# Altium schematic sheet Microcontroller.SchDoc
size A3; SheetNumber: 3; SheetTotal: 7
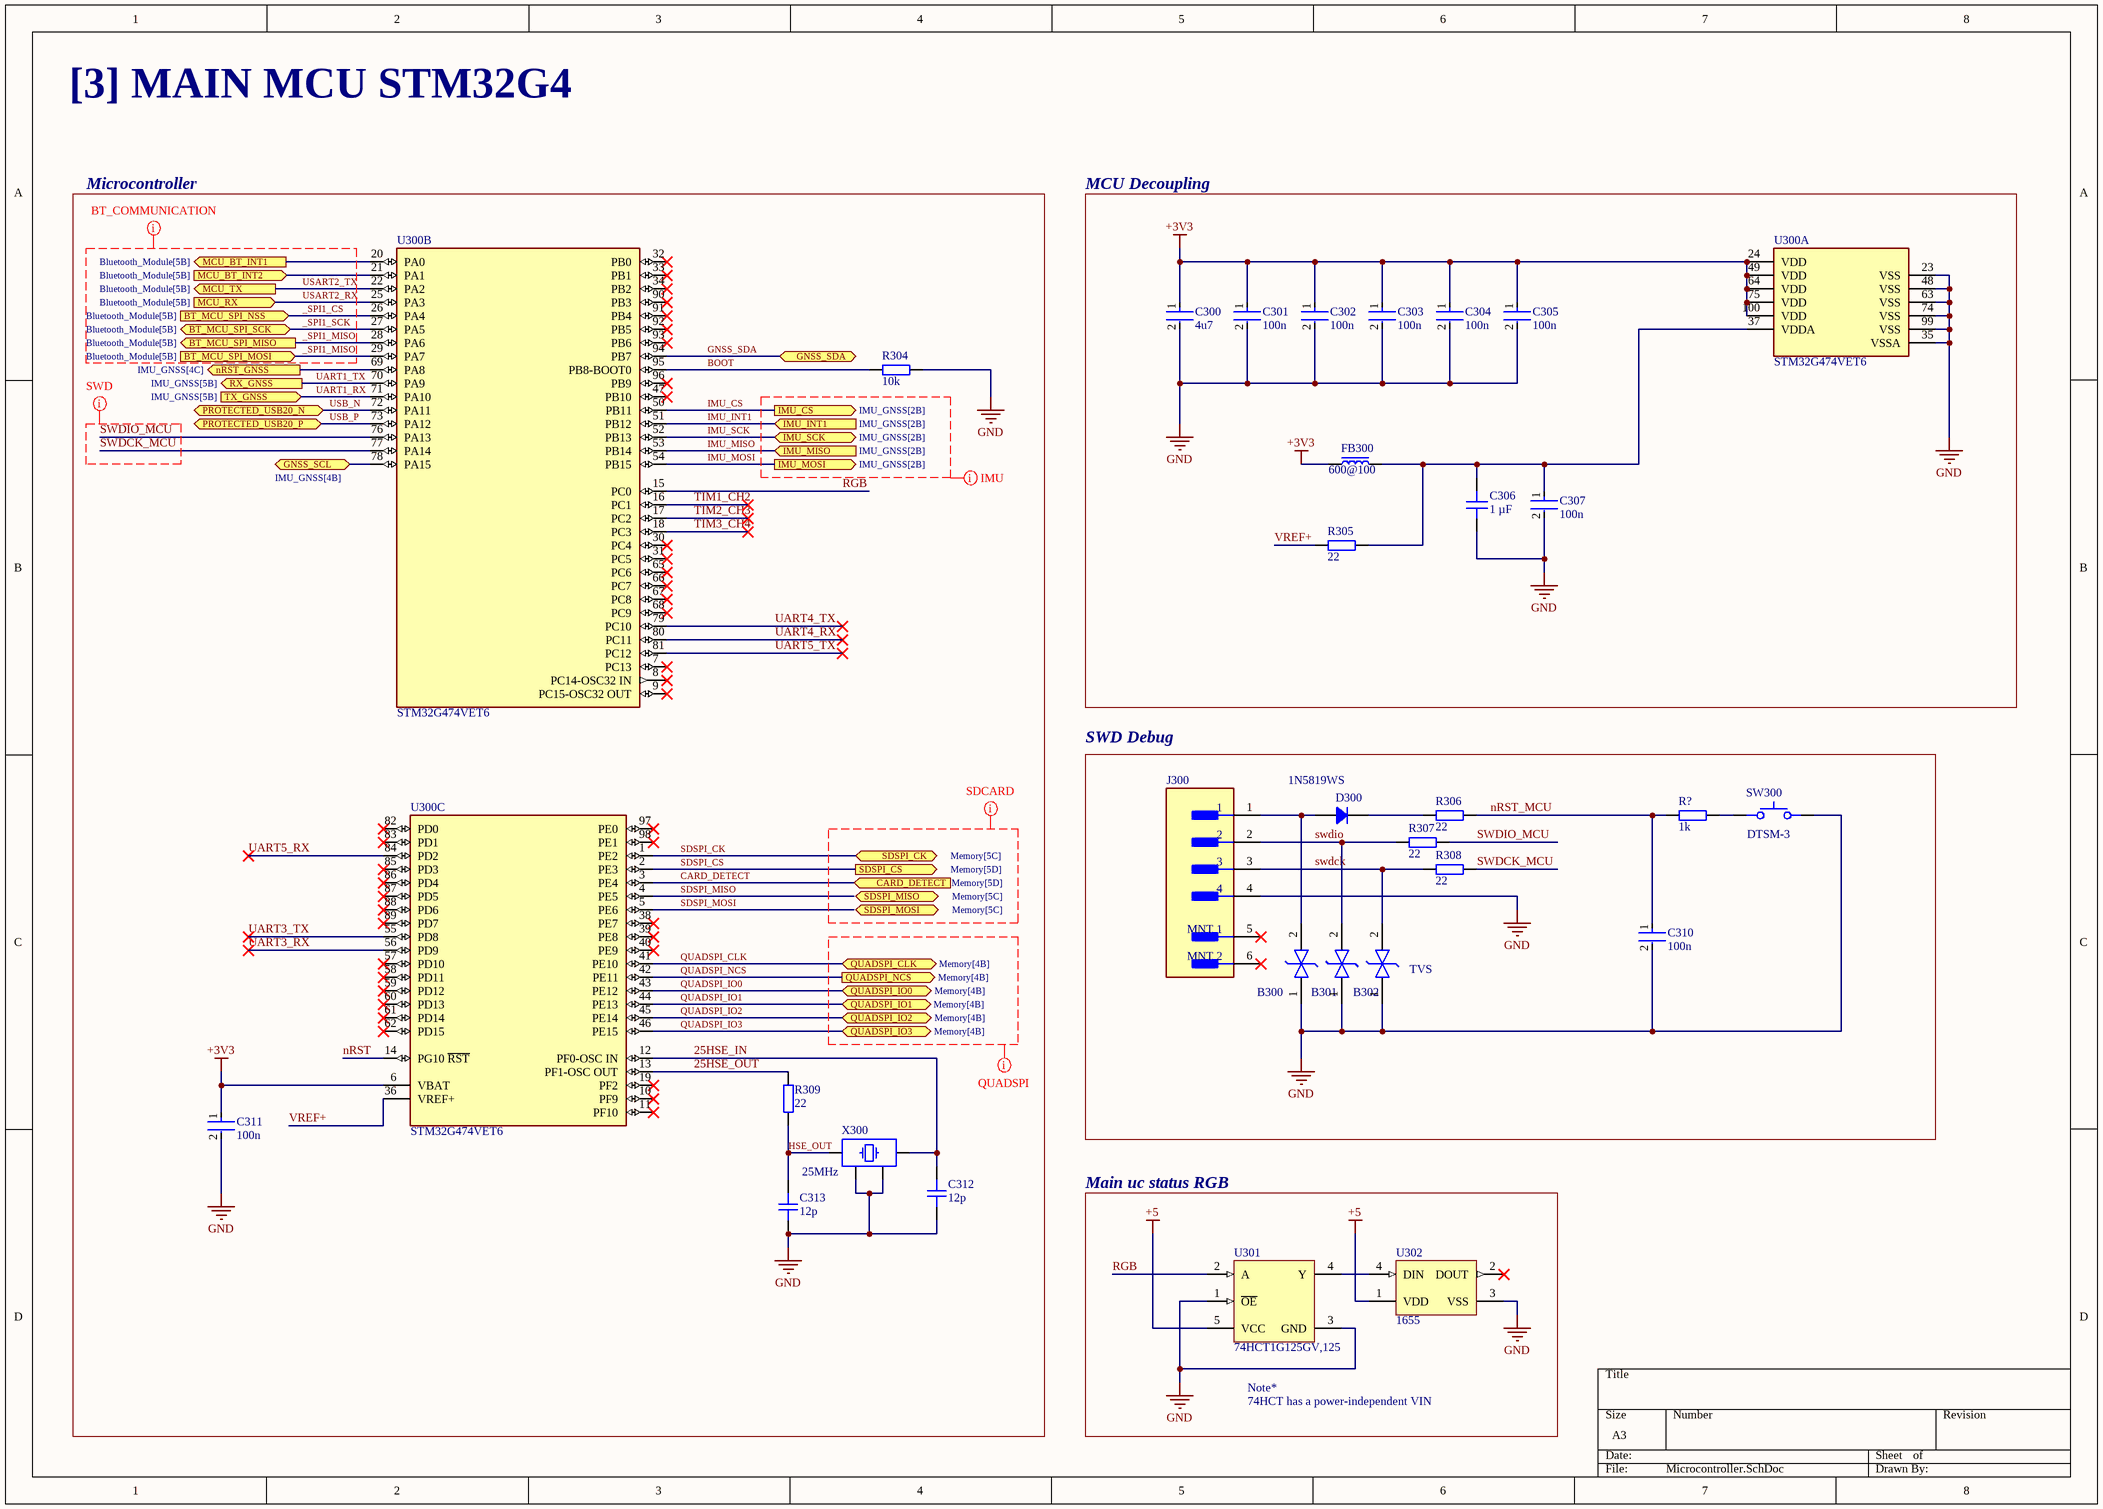
[diagram p0: Microcontroller.SchDoc]

## Parts
B300  TVS  [SODFL1608X65N]  (value not drawn)
B301  TVS  [SODFL1608X65N]  (value not drawn)
B302  TVS  [SODFL1608X65N]
C300  4u7  [FP-CL10-IPC_C]
C301  100n  [FP-CL779-IPC_C]
C302  100n  [FP-CL779-IPC_C]
C303  100n  [FP-CL779-IPC_C]
C304  100n  [FP-CL779-IPC_C]
C305  100n  [FP-CL779-IPC_C]
C306  1 µF  [CAP 0402_1005]
C307  100n  [FP-CL779-IPC_C]
C310  100n  [FP-CL779-IPC_C]
C311  100n  [FP-CL779-IPC_C]
C312  12p  [CAP_0402]
C313  12p  [CAP_0402]
D300  1N5819WS  [SOD323F]
FB300  600@100  [FB_0603]
J300  S4B-XH-SM4-TB(LF)(SN)  [FP-S4B-XH-SM4-TB_LF_SN-MFG]  (value not drawn)
R304  10k  [RES_0402]
R305  22  [RES_0402]
R306  22  [RES_0402]
R307  22  [RES_0402]
R308  22  [RES_0402]
R309  22  [RES_0402]
R?  1k  [RES_0402]
SW300  DTSM-3  [DTSM-3]
U300  STM32G474VET6  [FP-LQFP100-1L-IPC_B]  (parts A,B,C of 3)
U301  74HCT1G125GV,125  [NXP-SOT753_V]
U302  1655  [ADA-RGB-1655_V]
X300  25MHz  [XTAL_3225]

## Blocks framed on the sheet
Microcontroller: C311-C313 R304 R309 U300 X300
MCU Decoupling: C300-C307 FB300 R305 U300
SWD Debug: B300-B302 C310 D300 J300 R306-R308 R? SW300
Main uc status RGB: U301 U302

## Ports
BT_MCU_SPI_MISO (out, see Bluetooth_Module[5B]), BT_MCU_SPI_MOSI (in, see Bluetooth_Module[5B]), BT_MCU_SPI_NSS (in, see Bluetooth_Module[5B]), BT_MCU_SPI_SCK (bidir, see Bluetooth_Module[5B]), CARD_DETECT (in, see Memory[5D]), GNSS_SCL (bidir, see IMU_GNSS[4B]), GNSS_SDA (bidir, see IMU_GNSS[4B]), IMU_CS (out, see IMU_GNSS[2B]), IMU_INT1 (in, see IMU_GNSS[2B]), IMU_MISO (in, see IMU_GNSS[2B]), IMU_MOSI (out, see IMU_GNSS[2B]), IMU_SCK (bidir, see IMU_GNSS[2B]), MCU_BT_INT1 (out, see Bluetooth_Module[5B]), MCU_BT_INT2 (in, see Bluetooth_Module[5B]), MCU_RX (in, see Bluetooth_Module[5B]), MCU_TX (out, see Bluetooth_Module[5B]), nRST_GNSS (out, see IMU_GNSS[4C]), PROTECTED_USB20_N (bidir, see Connectors[2B]), PROTECTED_USB20_P (bidir, see Connectors[2B]), QUADSPI_CLK (bidir, see Memory[4B]), QUADSPI_IO0 (bidir, see Memory[4B]), QUADSPI_IO1 (bidir, see Memory[4B]), QUADSPI_IO2 (bidir, see Memory[4B]), QUADSPI_IO3 (bidir, see Memory[4B]), QUADSPI_NCS (out, see Memory[4B]), RX_GNSS (out, see IMU_GNSS[5B]), SDSPI_CK (bidir, see Memory[5C]), SDSPI_CS (out, see Memory[5D]), SDSPI_MISO (bidir, see Memory[5C]), SDSPI_MOSI (bidir, see Memory[5C]), TX_GNSS (in, see IMU_GNSS[5B])

## Nets
+3V3: C300.1 C301.1 C302.1 C303.1 C304.1 C305.1 C311.1 FB300.1 U300.6(VBAT) U300.24(VDD) U300.49(VDD) U300.64(VDD) U300.75(VDD) U300.100(VDD)
+5: U301.5(VCC) U302.1(VDD)
GND: B300.1(K1) B301.1(K1) B302.1(K1) C300.2 C301.2 C302.2 C303.2 C304.2 C305.2 C306.1 C307.2 C310.2 C311.2 C312.1 C313.1 J300.4 R304.1 SW300.2 U300.23(VSS) U300.35(VSSA) U300.48(VSS) U300.63(VSS) U300.74(VSS) U300.99(VSS) U301.1(~{OE}) U301.3(GND) U302.3(VSS) X300.2 X300.4
25HSE_IN: C312.2 U300.12(PF0-OSC_IN) X300.3
25HSE_OUT: R309.1 U300.13(PF1-OSC_OUT)
_SPI1_CS: U300.26(PA4) ; port BT_MCU_SPI_NSS
_SPI1_MISO: U300.28(PA6) U300.29(PA7) ; port BT_MCU_SPI_MOSI, port BT_MCU_SPI_MISO
_SPI1_SCK: U300.27(PA5) ; port BT_MCU_SPI_SCK
BOOT: R304.2 U300.95(PB8-BOOT0)
CARD_DETECT: U300.3(PE4) ; port CARD_DETECT
GNSS_SCL: U300.78(PA15) ; port GNSS_SCL
GNSS_SDA: U300.94(PB7) ; port GNSS_SDA
HSE_OUT: C313.2 R309.2 X300.1
IMU_CS: U300.50(PB11) ; port IMU_CS
IMU_INT1: U300.51(PB12) ; port IMU_INT1
IMU_MISO: U300.53(PB14) ; port IMU_MISO
IMU_MOSI: U300.54(PB15) ; port IMU_MOSI
IMU_SCK: U300.52(PB13) ; port IMU_SCK
MCU_BT_INT1: U300.20(PA0) ; port MCU_BT_INT1
MCU_BT_INT2: U300.21(PA1) ; port MCU_BT_INT2
nRST: U300.14(PG10_~{RST})
nRST_GNSS: U300.69(PA8) ; port nRST_GNSS
nRST_MCU: C310.1 R306.1 R?.2
QUADSPI_CLK: U300.41(PE10) ; port QUADSPI_CLK
QUADSPI_IO0: U300.43(PE12) ; port QUADSPI_IO0
QUADSPI_IO1: U300.44(PE13) ; port QUADSPI_IO1
QUADSPI_IO2: U300.45(PE14) ; port QUADSPI_IO2
QUADSPI_IO3: U300.46(PE15) ; port QUADSPI_IO3
QUADSPI_NCS: U300.42(PE11) ; port QUADSPI_NCS
RGB: U300.15(PC0) U301.2(A)
SDSPI_CK: U300.1(PE2) ; port SDSPI_CK
SDSPI_CS: U300.2(PE3) ; port SDSPI_CS
SDSPI_MISO: U300.4(PE5)
SDSPI_MOSI: U300.5(PE6)
swdck: B302.2(K2) J300.3 R308.2
SWDCK_MCU: R308.1 U300.77(PA14)
swdio: B301.2(K2) J300.2 R307.2
SWDIO_MCU: R307.1 U300.76(PA13)
TIM1_CH2: U300.16(PC1)
TIM2_CH3: U300.17(PC2)
TIM3_CH4: U300.18(PC3)
UART1_RX: U300.71(PA10) ; port TX_GNSS
UART1_TX: U300.70(PA9) ; port RX_GNSS
UART3_RX: U300.56(PD9)
UART3_TX: U300.55(PD8)
UART4_RX: U300.80(PC11)
UART4_TX: U300.79(PC10)
UART5_RX: U300.84(PD2)
UART5_TX: U300.81(PC12)
USART2_RX: U300.25(PA3) ; port MCU_RX
USART2_TX: U300.22(PA2) ; port MCU_TX
USB_N: U300.72(PA11) ; port PROTECTED_USB20_N
USB_P: U300.73(PA12) ; port PROTECTED_USB20_P
VREF+: R305.1 U300.36(VREF+)
NetB300_2: B300.2(K2) D300.1 J300.1
NetC306_2: C306.2 C307.1 FB300.2 R305.2 U300.37(VDDA)
NetD300_2: D300.2 R306.2
NetR?_1: R?.1 SW300.1
NetU301_4: U301.4(Y) U302.4(DIN)

Not connected (* = marked no-connect by the designer): J300 5(MNT_1)* 6(MNT_2)*; U300 7(PC13)* 8(PC14-OSC32_IN)* 9(PC15-OSC32_OUT)* 10(PF9)* 11(PF10)* 19(PF2)* 30(PC4)* 31(PC5)* 32(PB0)* 33(PB1)* 34(PB2)* 38(PE7)* 39(PE8)* 40(PE9)* 47(PB10)* 57(PD10)* 58(PD11)* 59(PD12)* 60(PD13)* 61(PD14)* 62(PD15)* 65(PC6)* 66(PC7)* 67(PC8)* 68(PC9)* 82(PD0)* 83(PD1)* 85(PD3)* 86(PD4)* 87(PD5)* 88(PD6)* 89(PD7)* 90(PB3)* 91(PB4)* 92(PB5)* 93(PB6)* 96(PB9)* 97(PE0)* 98(PE1)*; U302 2(DOUT)*

## Layout directives
net class DEBUG: SWDCK_MCU, SWDIO_MCU
net class QUADSPI: (no net found under the mark)
net class IMU_SPI: (no net found under the mark)
net class BT_MCU_COMMUNICATION: _SPI1_CS, _SPI1_MISO, _SPI1_SCK, USART2_RX, USART2_TX
net class SD: (no net found under the mark)

## Notes on the sheet
- [3] MAIN MCU STM32G4
- Note*
- 74HCT has a power-independent VIN

## Library data of the parts
B300-B302 = PESD5V0S1BB_115: PESD5V0S1BB - Bidirectional ESD protection diode Vbr = 5.5V, Vc; Manufacturer_Name: Nexperia; Manufacturer_Part_Number: PESD5V0S1BB,115; Geometry.Height: 0.65mm; Mouser Part Number: 771-PESD5V0S1BB-T/R; Mouser Price/Stock: https://www.mouser.co.uk/ProductDetail/Nexperia/PESD5V0S1BB115?qs=LOCUfHb8d9vW06zz0pOppQ%3D%3D; Arrow Part Number: PESD5V0S1BB,115; Arrow Price/Stock: https://www.arrow.com/en/products/pesd5v0s1bb115/nexperia; Datasheet Link: https://assets.nexperia.com/documents/data-sheet/PESD5V0S1BB.pdf
C300 = CMP-13271-004224-1: Cap Ceramic 10uF 25V X5R ±20% Pad SMD 0603 +85°C T/R; Width: 0.031inch; Voltage Rating: 25V; Length: 0.063inch; Case Code (Metric): 1608; Dielectric: X5R; Termination: Wraparound; Capacitance: 10uF; Lead Free: Lead Free; Mount: Surface Mount; Package Quantity: 1; Case Code (Imperial): 0603; Thickness: 0.035inch; Packaging: Tape and Reel; Contact Plating: Tin; Min Operating Temperature: -55°C; Tolerance: 20%; Max Operating Temperature: 85°C; Case/Package: 0603
C301-C305 C307 C310 C311 = CMP-13271-002336-1: Cap Ceramic 100nF 50V X7R ±10% SMD 0402 +125°C Paper T/R CL05B104KB54PNC
C306 = CL05A105KA5NQNC: CAP CER 1UF 25V X5R 0402; manufacturer: Samsung Electro-Mechanics; Tolerance: ±10%; Part Number: CL05A105KA5NQNC; Value: 1 µF; Applications: General Purpose; Capacitance: 1 µF; componentlink1description: Datasheet; componentlink1url: http://www.samsungsem.com/kr/support/product-search/mlcc/CL05A105KA5NQNC.jsp; componentlink2description: DigiKey Link; componentlink2url: https://www.digikey.com/en/products/detail/samsung-electro-mechanics/CL05A105KA5NQNC/3887103; Device Package: 0402 (1005 Metric); lastupdated: 26.01.2024 20:04:14; Lifecycle Status: Active; Minimum Order: 1; Mounting Type: Surface Mount, MLCC; Operating Temperature: -55°C ~ 85°C; Package / Case: 0402 (1005 Metric); packaging: TapeAndReel; partid: 8675; Part Status: Active; price: 0.02; series: CL; Size / Dimension: 0.039" L x 0.020" W (1.00mm x 0.50mm); Supplier 1: DigiKey; Supplier Part Number 1: 1276-1445-1-ND; Temperature Coefficient: X5R; Thickness (Max): 0.022" (0.55mm); Voltage - Rated: 25V
C312 C313 = CAP_0402: Capacitor SMD 0402 0402CG120J500NT; Manufacturer: *; Manufacturer Part Number: *; Distributor Link: *; LCSC: *; Rating: *; Dielectric: *
D300 = 1N4148WS: 40V 600mV@1A 1A SOD-323 1N5819WS; Manufacturer: ON Semiconductor; Current - Average Rectified (Io): 150mA; Current - Reverse Leakage @ Vr: 5µA @ 75V; Diode Type: Standard; Reverse Recovery Time (trr): 4ns; Speed: Small Signal =< 200mA (Io), Any Speed; Voltage - DC Reverse (Vr) (Max): 75V; Voltage - Forward (Vf) (Max) @ If: 1V @ 10mA; Part Number: 1N4148WS; ComponentLink1Description: Datasheet; ComponentLink1URL: https://www.onsemi.com/pub/Collateral/1N914BWS-D.pdf; ComponentLink2Description: DigiKey Link; ComponentLink2URL: http://digikey.com/product-detail/en/on-semiconductor/1N4148WS/1N4148WSFSCT-ND/1873821; LastUpdated: 29.01.2024 21:26:23; Lifecycle Status: Active; Minimum Order: 1; Mounting Type: Surface Mount; Operating Temperature - Junction: 150°C (Max); Package / Case: SC-90, SOD-323F; Packaging: TapeAndReel; PartId: 1158; Part Status: Active; Price: 0.03; Series: -; Supplier 1: DigiKey; Supplier Part Number 1: 1N4148WSFSCT-ND; Supplier Device Package: SOD-323F
FB300 = FB_0603: Ferrite Bead SMD 0603 GZ1608D601TF; Manufacturer: *; Manufacturer Part Number: *; Distributor Link: *; LCSC: *
J300 = CMP-17439-000072-1: CONN HEADER SMD R/A 4POS 2.5MM; Number of Positions: 4; Max Current Rating: 3A; Max Voltage Rating (AC): 250V; Connector Type: Male Pin; Contact Resistance: 20mR; Gender: Male; Pitch: 0.098inch; Max Operating Temperature: 85°C; Contact Plating: Tin; Housing Material: Polyamide; Housing Color: Beige; Depth: 10mm; Series: XH; Package Quantity: 1; Length: 15mm; Contact Material: Copper Alloy; Min Operating Temperature: -25°C; REACH SVHC: No SVHC; Orientation: Right Angle; Number of Rows: 1; Contact Type: Male Pin; Color: Natural; Lead Free: Lead Free; Termination: Solder; Mount: Surface Mount; Number of Contacts: 4; Packaging: Tape and Reel
R304-R309 R? = RES_0402: Resistor SMD 0402; Manufacturer: *; Manufacturer Part Number: *; Distributor Link: *; LCSC: *
SW300 = DTSM-3: Tactile Switch SMD SPST; Manufacturer: Diptronics; Manufacturer Part Number: DTSM-3
U300 = CMP-12105-000116-1: IC MCU 32BIT 512KB FLASH 100LQFP; RoHS Compliant: Yes
U301 = CMP-1328-00004-1: High-Speed, Si-Gate CMOS Device, 4.5 to 5.5 V, -40 to 125 degC, 5-Pin SC-74A (SOT753), RoHS, Reel; Manufacturer: NXP Semiconductors; Ci: 1.5 pF Typ.; CPD: 27 pF Typ.; VO: 0 to 5.5 V; PartNumber: 74HCT1G125GV,125; ComponentLink3Description: Package Specification; ComponentLink1URL: http://www.nxp.com/; Temperature Range: -40 to 125 degC; ComponentLink3URL: http://www.nxp.com/documents/outline_drawing/sot753_po.pdf; RoHS: TRUE; Mounting Technology: Surface Mount; PackageVersion: Mar-06; Packing: Reel; ComponentLink2Description: Datasheet; ComponentLink2URL: http://www.nxp.com/documents/data_sheet/74HC_HCT1G125.pdf; PackageDescription: 5-Pin Plastic Surface Mounted Package, Body 2.9 x 1.5 mm, Pitch 0.95 mm; DatasheetVersion: Rev. 05; VCC: 4.5 to 5.5 V; ComponentLink1Description: Manufacturer URL; VI: 0 to 5.5 V
U302 = CMP-2000-05026-1: Intelligent Control LED Integrated Light Source, 3.5 to 5.3 V, -25 to 80 degC, 4-Pin SMD, RoHS, Tape and Reel; Manufacturer: Adafruit-Industries-LLC; Number of LEDs: 10; Configuration: Discrete; Utilized LED: WS2812(5050); Datasheet URL: http://datasheet.octopart.com/ADA1655-Adafruit-Industries-datasheet-32028139.pdf; Series: Neopixel; Interface: -; Package Description: 4-Pin Surface Mount Device, Body 5 x 5 mm; Color: Red,Green,Blue(RGB); Category: Optoelectronics; Controller Type: -; Package Reference: 1655; Manufacturer URL: https://www.adafruit.com/; Mounting Type: SurfaceMount; Datasheet Version: May-13; Size / Dimension: 5.00mmLx5.00mmW; Family: Addressable,Specialty
X300 = TSX-3225_24.0000MF15X-AC: Crystal SMD 24MHz 10PPM 7pF 3225; Manufacturer: Epson; Manufacturer Part Number: TSX-3225 24.0000MF15X-AC